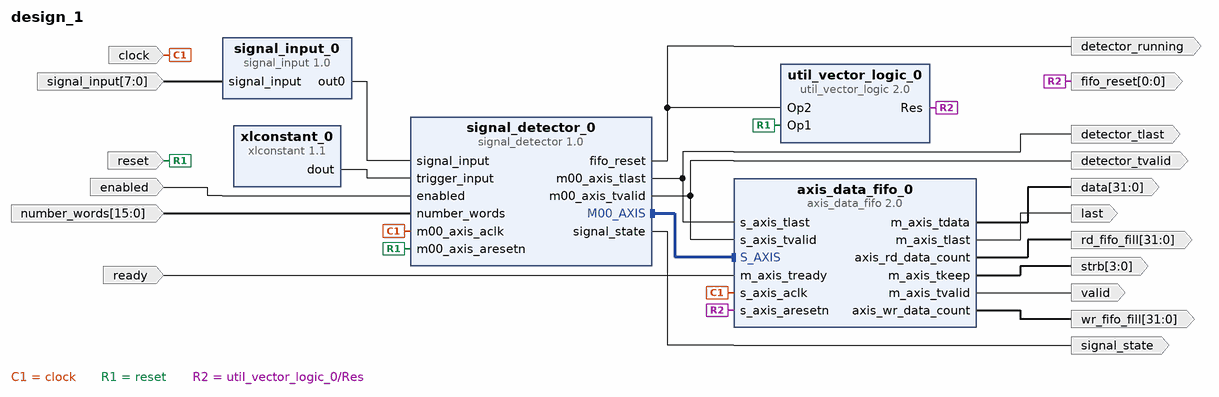
[diagram p0: block diagram of the top level]
# Vivado block design design_1, xc7z020clg484-1, Vivado 2019.2.1
create_bd_design design_1

create_bd_port -dir I enabled
create_bd_port -dir I -type clk clock
set_property -dict {CONFIG.FREQ_HZ 100000000} [get_bd_ports clock]
create_bd_port -dir I -type rst reset
create_bd_port -dir O signal_state
create_bd_port -dir O -from 31 -to 0 data
create_bd_port -dir O last
create_bd_port -dir I ready
create_bd_port -dir O valid
create_bd_port -dir O -from 31 -to 0 wr_fifo_fill
create_bd_port -dir O -from 31 -to 0 rd_fifo_fill
create_bd_port -dir O -from 3 -to 0 strb
create_bd_port -dir O -from 0 -to 0 fifo_reset
create_bd_port -dir I -from 7 -to 0 signal_input
create_bd_port -dir I -from 15 -to 0 number_words
create_bd_port -dir O detector_tlast
create_bd_port -dir O detector_tvalid
create_bd_port -dir O detector_running

create_bd_cell -type ip -vlnv xilinx.com:ip:axis_data_fifo:2.0 axis_data_fifo_0
set_property -dict [list \
  CONFIG.FIFO_DEPTH 1024 \
  CONFIG.HAS_RD_DATA_COUNT 1 \
  CONFIG.HAS_TKEEP 1 \
  CONFIG.HAS_TSTRB 0 \
  CONFIG.HAS_WR_DATA_COUNT 1 \
] [get_bd_cells axis_data_fifo_0]
create_bd_cell -type ip -vlnv xilinx.com:ip:util_vector_logic:2.0 util_vector_logic_0
set_property -dict {CONFIG.C_OPERATION and CONFIG.C_SIZE 1} [get_bd_cells util_vector_logic_0]
create_bd_cell -type ip -vlnv user.org:user:signal_input:1.0 signal_input_0
create_bd_cell -type ip -vlnv akr.neutron:user:signal_detector:1.0 signal_detector_0
set_property -dict {CONFIG.C_M00_AXIS_START_COUNT 32} [get_bd_cells signal_detector_0]
create_bd_cell -type ip -vlnv xilinx.com:ip:xlconstant:1.1 xlconstant_0

# ---- connections ----

connect_bd_intf_net [get_bd_intf_pins signal_detector_0/M00_AXIS] [get_bd_intf_pins axis_data_fifo_0/S_AXIS]
connect_bd_net [get_bd_ports enabled] [get_bd_pins signal_detector_0/enabled]
connect_bd_net [get_bd_ports clock] [get_bd_pins axis_data_fifo_0/s_axis_aclk] [get_bd_pins signal_detector_0/m00_axis_aclk]
connect_bd_net [get_bd_pins signal_detector_0/signal_state] [get_bd_ports signal_state]
connect_bd_net [get_bd_pins axis_data_fifo_0/axis_wr_data_count] [get_bd_ports wr_fifo_fill]
connect_bd_net [get_bd_pins axis_data_fifo_0/m_axis_tdata] [get_bd_ports data]
connect_bd_net [get_bd_ports ready] [get_bd_pins axis_data_fifo_0/m_axis_tready]
connect_bd_net [get_bd_pins axis_data_fifo_0/m_axis_tlast] [get_bd_ports last]
connect_bd_net [get_bd_pins axis_data_fifo_0/m_axis_tvalid] [get_bd_ports valid]
connect_bd_net [get_bd_pins axis_data_fifo_0/axis_rd_data_count] [get_bd_ports rd_fifo_fill]
connect_bd_net [get_bd_ports reset] [get_bd_pins util_vector_logic_0/Op1] [get_bd_pins signal_detector_0/m00_axis_aresetn]
connect_bd_net [get_bd_pins signal_detector_0/fifo_reset] [get_bd_pins util_vector_logic_0/Op2] [get_bd_ports detector_running]
connect_bd_net [get_bd_pins util_vector_logic_0/Res] [get_bd_pins axis_data_fifo_0/s_axis_aresetn] [get_bd_ports fifo_reset]
connect_bd_net -net signal_input_1_1 [get_bd_ports signal_input] [get_bd_pins signal_input_0/signal_input]
connect_bd_net [get_bd_pins signal_input_0/out0] [get_bd_pins signal_detector_0/signal_input]
connect_bd_net [get_bd_ports number_words] [get_bd_pins signal_detector_0/number_words]
connect_bd_net [get_bd_pins signal_detector_0/m00_axis_tlast] [get_bd_ports detector_tlast] [get_bd_pins axis_data_fifo_0/s_axis_tlast]
connect_bd_net [get_bd_pins signal_detector_0/m00_axis_tvalid] [get_bd_ports detector_tvalid] [get_bd_pins axis_data_fifo_0/s_axis_tvalid]
connect_bd_net [get_bd_pins axis_data_fifo_0/m_axis_tkeep] [get_bd_ports strb]
connect_bd_net [get_bd_pins xlconstant_0/dout] [get_bd_pins signal_detector_0/trigger_input]

validate_bd_design
save_bd_design
